# Altium schematic sheet AllPins_MCU.SchDoc
size A4; SheetNumber: 7; SheetTotal: 10
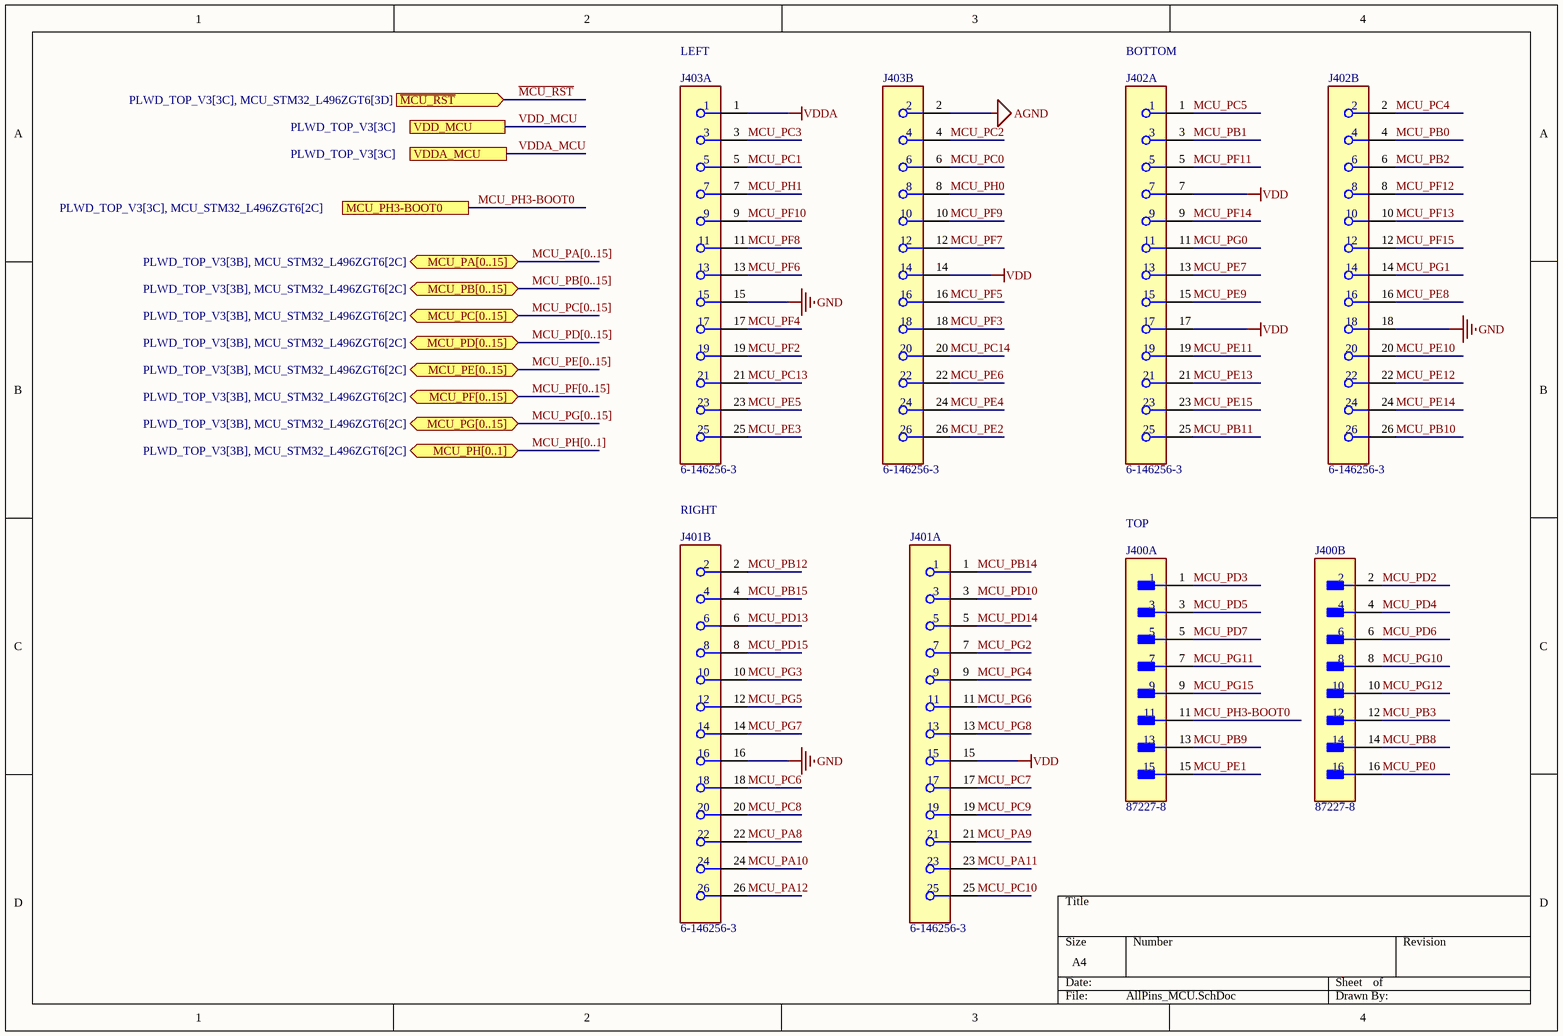
[diagram p0: AllPins_MCU.SchDoc]

## Parts
J400  87227-8  [FP-87227-8-MFG]  (parts A,B of 2)
J401  6-146256-3  [FP-6-146256-3-MFG]  (parts A,B of 2)
J402  6-146256-3  [FP-6-146256-3-MFG]  (parts A,B of 2)
J403  6-146256-3  [FP-6-146256-3-MFG]  (parts A,B of 2)

## Ports
MCU_PA[0..15] (bidir, see PLWD_TOP_V3[3B], MCU_STM32_L496ZGT6[2C]), MCU_PB[0..15] (bidir, see PLWD_TOP_V3[3B], MCU_STM32_L496ZGT6[2C]), MCU_PC[0..15] (bidir, see PLWD_TOP_V3[3B], MCU_STM32_L496ZGT6[2C]), MCU_PD[0..15] (bidir, see PLWD_TOP_V3[3B], MCU_STM32_L496ZGT6[2C]), MCU_PE[0..15] (bidir, see PLWD_TOP_V3[3B], MCU_STM32_L496ZGT6[2C]), MCU_PF[0..15] (bidir, see PLWD_TOP_V3[3B], MCU_STM32_L496ZGT6[2C]), MCU_PG[0..15] (bidir, see PLWD_TOP_V3[3B], MCU_STM32_L496ZGT6[2C]), MCU_PH3-BOOT0 (see PLWD_TOP_V3[3C], MCU_STM32_L496ZGT6[2C]), MCU_PH[0..1] (bidir, see PLWD_TOP_V3[3B], MCU_STM32_L496ZGT6[2C]), VDD_MCU (see PLWD_TOP_V3[3C]), VDDA_MCU (see PLWD_TOP_V3[3C]), ~{MCU_RST} (in, see PLWD_TOP_V3[3C], MCU_STM32_L496ZGT6[3D])

## Nets
AGND: J403.2
GND: J401.16 J402.18 J403.15
VDD: J401.15 J402.7 J402.17 J403.14
VDDA: J403.1
~{MCU_RST}: port ~{MCU_RST}
MCU_PA8: J401.22
MCU_PA9: J401.21
MCU_PA10: J401.24
MCU_PA11: J401.23
MCU_PA12: J401.26
MCU_PB0: J402.4
MCU_PB1: J402.3
MCU_PB2: J402.6
MCU_PB3: J400.12
MCU_PB8: J400.14
MCU_PB9: J400.13
MCU_PB10: J402.26
MCU_PB11: J402.25
MCU_PB12: J401.2
MCU_PB14: J401.1
MCU_PB15: J401.4
MCU_PC0: J403.6
MCU_PC1: J403.5
MCU_PC2: J403.4
MCU_PC3: J403.3
MCU_PC4: J402.2
MCU_PC5: J402.1
MCU_PC6: J401.18
MCU_PC7: J401.17
MCU_PC8: J401.20
MCU_PC9: J401.19
MCU_PC10: J401.25
MCU_PC13: J403.21
MCU_PC14: J403.20
MCU_PD2: J400.2
MCU_PD3: J400.1
MCU_PD4: J400.4
MCU_PD5: J400.3
MCU_PD6: J400.6
MCU_PD7: J400.5
MCU_PD10: J401.3
MCU_PD13: J401.6
MCU_PD14: J401.5
MCU_PD15: J401.8
MCU_PE0: J400.16
MCU_PE1: J400.15
MCU_PE2: J403.26
MCU_PE3: J403.25
MCU_PE4: J403.24
MCU_PE5: J403.23
MCU_PE6: J403.22
MCU_PE7: J402.13
MCU_PE8: J402.16
MCU_PE9: J402.15
MCU_PE10: J402.20
MCU_PE11: J402.19
MCU_PE12: J402.22
MCU_PE13: J402.21
MCU_PE14: J402.24
MCU_PE15: J402.23
MCU_PF2: J403.19
MCU_PF3: J403.18
MCU_PF4: J403.17
MCU_PF5: J403.16
MCU_PF6: J403.13
MCU_PF7: J403.12
MCU_PF8: J403.11
MCU_PF9: J403.10
MCU_PF10: J403.9
MCU_PF11: J402.5
MCU_PF12: J402.8
MCU_PF13: J402.10
MCU_PF14: J402.9
MCU_PF15: J402.12
MCU_PG0: J402.11
MCU_PG1: J402.14
MCU_PG2: J401.7
MCU_PG3: J401.10
MCU_PG4: J401.9
MCU_PG5: J401.12
MCU_PG6: J401.11
MCU_PG7: J401.14
MCU_PG8: J401.13
MCU_PG10: J400.8
MCU_PG11: J400.7
MCU_PG12: J400.10
MCU_PG15: J400.9
MCU_PH0: J403.8
MCU_PH1: J403.7
MCU_PH3-BOOT0: J400.11 ; port MCU_PH3-BOOT0
VDD_MCU: port VDD_MCU
VDDA_MCU: port VDDA_MCU

## Buses and harness runs
bus MCU_PA[0..15] = port MCU_PA[0..15]
bus MCU_PB[0..15] = port MCU_PB[0..15]
bus MCU_PC[0..15] = port MCU_PC[0..15]
bus MCU_PD[0..15] = port MCU_PD[0..15]
bus MCU_PE[0..15] = port MCU_PE[0..15]
bus MCU_PF[0..15] = port MCU_PF[0..15]
bus MCU_PG[0..15] = port MCU_PG[0..15]
bus MCU_PH[0..1] = port MCU_PH[0..1]

## Notes on the sheet
- LEFT
- BOTTOM
- RIGHT
- TOP

## Library data of the parts
J400 = CMP-03369-000064-1: CONN HEADER VERT 16POS 2.54MM; Manufacturer: TE Connectivity; Conn Gender: Male; Conn Orientation: Straight; Current Rating: 3A; Number Of Contacts: 16; Mouser Description: Headers & Wire Housings UNSHRD VERT DUAL 16; Lead Free: Yes; Digikey Description: CONN HEADER VERT 16POS 2.54MM; Device Class L3: unset; Automotive: No; Height: 0.428inch; Temperature Range Low: -65°C; Device Class L1: Connectors; RoHS: TRUE; Pitch: 2.54mm; Package: 0; Manufacturer Part Number: 87227-8; Number Of Rows: 2; Footprint Url: https://www.te.com/commerce/DocumentDelivery/DDEController?Action=showdoc&DocId=Customer+Drawing%7F87227%7FH4%7Fpdf%7FEnglish%7FENG_CD_87227_H4.pdf%7F87227-8; ComponentLink2URL: https://www.te.com/usa-en/product-87227-8.datasheet.pdf; ComponentLink2Description: Datasheet; Temperature: -65°C to +105°C; Category: Conn; Temperature Range High: +105°C; Octopart: https://octopart.com/87227-8-te+connectivity-39407754; Device Class L2: Headers and Wire Housings; Contact Material: Gold,Nickel
J401-J403 = CMP-03369-000069-1: CONN HEADER VERT 26POS 2.54MM; Manufacturer: TE Connectivity; Current Rating: 3A; Is Female: yes; Conn Gender: Male; Number Of Contacts: 26; Voltage Rating: 30V; Conn Orientation: Vertical; Temperature Range Low: -65°C; Mouser Description: Headers & Wire Housings 26P HDR DRST B/A; Lead Free: Yes; Automotive: No; Device Class L3: unset; Height: 8.72mm; ComponentLink2Description: Datasheet; Digikey Description: CONN HEADER VERT 26POS 2.54MM; Device Class L2: Headers and Wire Housings; Pitch: 2.54mm; Octopart: https://octopart.com/6-146256-3-te+connectivity-40624960; Contact Material: Gold,Nickel; RoHS: TRUE; Temperature Range High: +105°C; Temperature: -65°C to +105°C; Number Of Rows: 2; Category: Conn; Manufacturer Part Number: 6-146256-3; Device Class L1: Connectors; ComponentLink2URL: https://www.te.com/commerce/DocumentDelivery/DDEController?Action=showdoc&DocId=Customer+Drawing%7F146256%7FH%7Fpdf%7FEnglish%7FENG_CD_146256_H.pdf%7F6-146256-3; Package: 6-146256-3